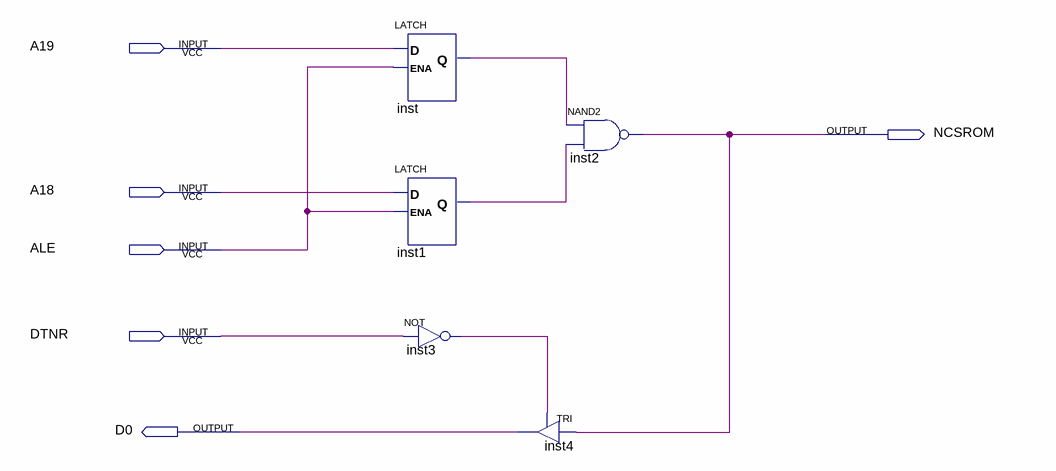
[diagram p0: schematic sheet]
// Quartus schematic Block1.bdf as structural Verilog: 5 symbols, 6 pins
module Block1 (
  input  A19,
  input  A18,
  input  ALE,
  input  DTNR,
  output NCSROM,
  output D0
);

  wire inst1_q, inst3_out, inst_q;

  LATCH inst (.D(A19), .ENA(ALE), .Q(inst_q));
  LATCH inst1 (.D(A18), .ENA(ALE), .Q(inst1_q));
  not inst3 (inst3_out, DTNR);
  TRI inst4 (.IN(NCSROM), .OE(inst3_out), .OUT(D0));
  nand inst2 (NCSROM, inst_q, inst1_q);
endmodule
